# EAGLE design relay (EAGLE 9.6.2)
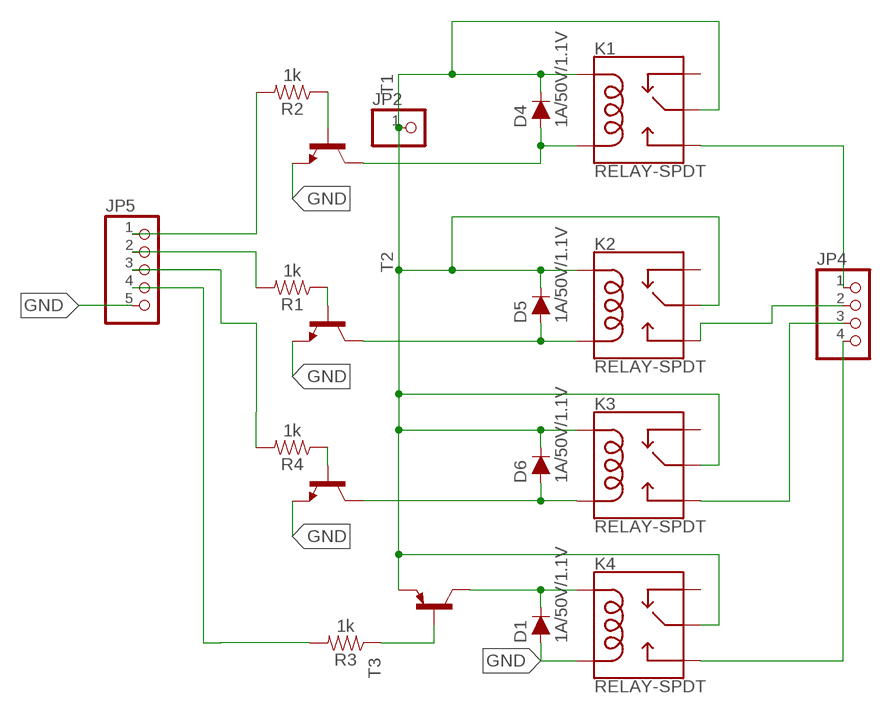
[diagram p0: schematic, sheet 1]

## Parts
D1  1A/50V/1.1V  DIODE-PTH  [DIODE-1N4001]
D4  1A/50V/1.1V  DIODE-PTH  [DIODE-1N4001]
D5  1A/50V/1.1V  DIODE-PTH  [DIODE-1N4001]
D6  1A/50V/1.1V  DIODE-PTH  [DIODE-1N4001]
JP2  PINHD-1X1  [1X01]
JP4  PINHD-1X4  [1X04]
JP5  PINHD-1X5  [1X05]
K1  RELAY-SPDT  [RELAY_G5LE]
K2  RELAY-SPDT  [RELAY_G5LE]
K3  RELAY-SPDT  [RELAY_G5LE]
K4  RELAY-SPDT  [RELAY_G5LE]
R1  1k  1KOHM-HORIZ-1/4W-1%  [AXIAL-0.3]
R2  1k  1KOHM-HORIZ-1/4W-1%  [AXIAL-0.3]
R3  1k  1KOHM-HORIZ-1/4W-1%  [AXIAL-0.3]
R4  1k  1KOHM-HORIZ-1/4W-1%  [AXIAL-0.3]
T1  2N5401-NPN-TO92-CBE  [TO92-CBE]
T2  2N5401-NPN-TO92-CBE  [TO92-CBE]
T3  2N4126-PNP-TO92-CBE  [TO92-CBE]
T4  2N5401-NPN-TO92-CBE  [TO92-CBE]

## Nets
124: D6.A K3.5(COIL2) T4.C
GND: D1.A JP5.5 K4.5(COIL2) T1.E T2.E T4.E
N$1: JP4.1 K1.3(NO)
N$2: JP4.2 K2.3(NO)
N$3: JP4.3 K3.3(NO)
N$5: D5.A K2.5(COIL2) T2.C
N$6: D4.A K1.5(COIL2) T1.C
N$7: R1.P$1 T2.B
N$8: D4.C D5.C D6.C JP2.1 K1.1(MAIN) K1.2(COIL1) K2.1(MAIN) K2.2(COIL1) K3.1(MAIN) K3.2(COIL1) K4.1(MAIN) T3.E
N$9: R3.P$1 T3.B
N$10: JP5.3 R4.P$2
N$11: JP5.2 R1.P$2
N$12: JP5.1 R2.P$2
N$13: R2.P$1 T1.B
N$18: JP4.4 K4.3(NO)
N$19: D1.C K4.2(COIL1) T3.C
N$21: R4.P$1 T4.B
N$23: JP5.4 R3.P$2
Unconnected: K1.4(NC) K2.4(NC) K3.4(NC) K4.4(NC)

## Library data of the parts
D1 D4-D6 = SparkFun-DiscreteSemi:DIODE: Diode These are standard reverse protection diodes and small signal diodes. SparkFun Products: SparkFun SparkPunk Sound Kit <https://www.sparkfun.com/products/11177> SparkFun ESP8266 Thing <https://www.sparkfun.com/products/13231>; PROD_ID: DIO-09176
JP2 = pinhead:PINHD-1X1: PIN HEADER
JP4 = pinhead:PINHD-1X4: PIN HEADER
JP5 = pinhead:PINHD-1X5: PIN HEADER
K1-K4 = SparkFun-Electromechanical:RELAY-SPDT: SPDT Electromechanical Relay Single-pole, double-throw sealed relays. When current is applied to the coil, it throws a simple changeover switch, terminating the connection from the NC contact to ground and closing the NO contact. Use them to switch high voltage/high current devices. SparkFun Products JQX-15F: Relay SPDT Sealed - 20A <https://www.sparkfun.com/products/10924> (COM-10924) JZC-11F: Relay SPDT Sealed <https://www.sparkfun.com/products/100> (COM-00100); PROD_ID: COMP-14214
R1-R4 = SparkFun-Resistors:1KOHM: 1kΩ resistor A resistor is a passive two-terminal electrical component that implements electrical resistance as a circuit element. Resistors act to reduce current flow, and, at the same time, act to lower voltage levels within circuits. - Wikipedia; PROD_ID: RES-12182
T1 = transistor:*-NPN-: NPN Transistror BF959 corrected 2008.03.06
T2 T4 = transistor:*-NPN-: NPN Transistror BF959 corrected 2008.03.06; SPICEPREFIX: J
T3 = transistor:*-PNP-: PNP Transistror

## Board
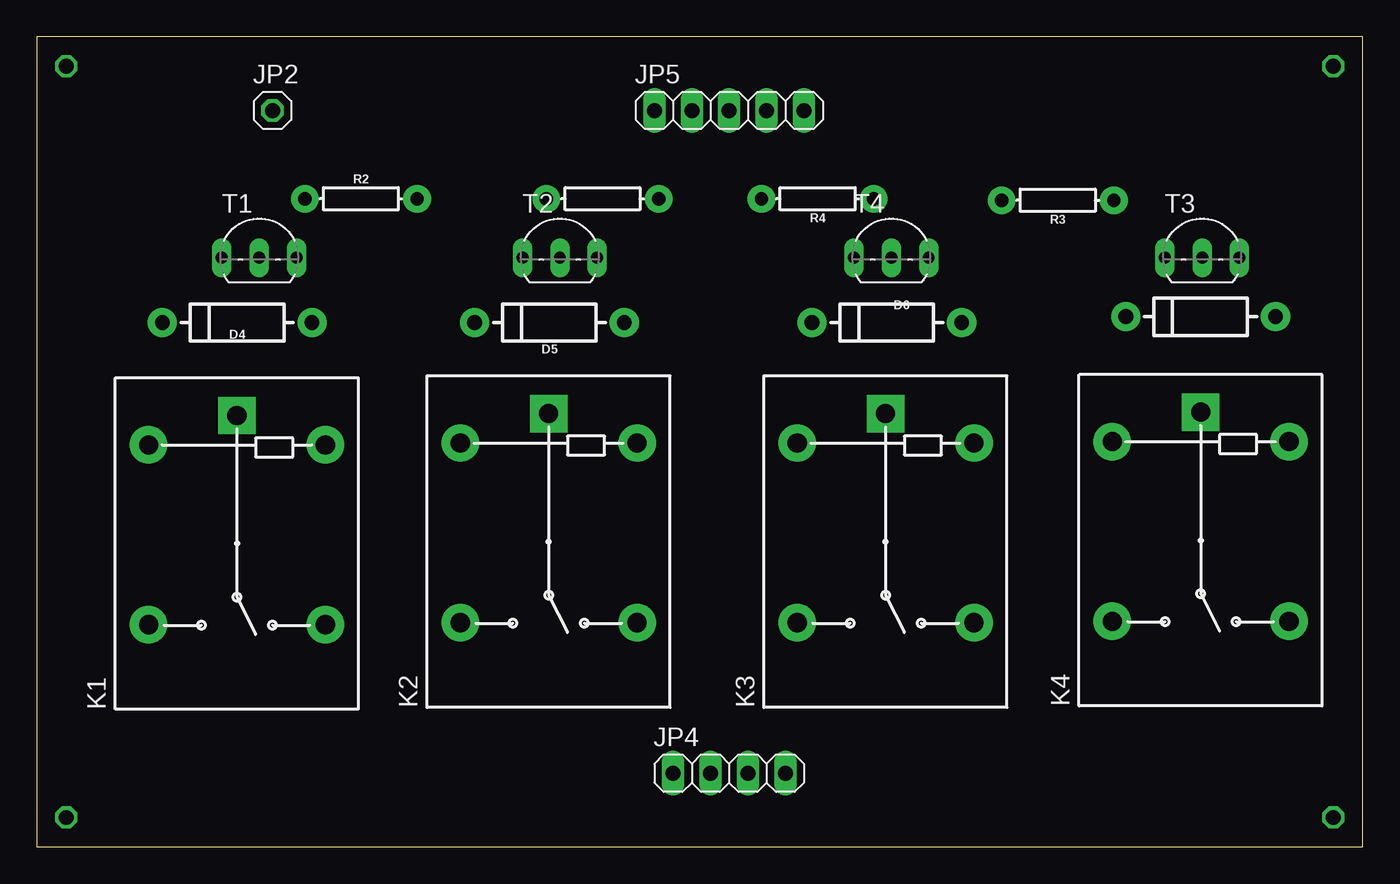
[diagram p1: board, top side]
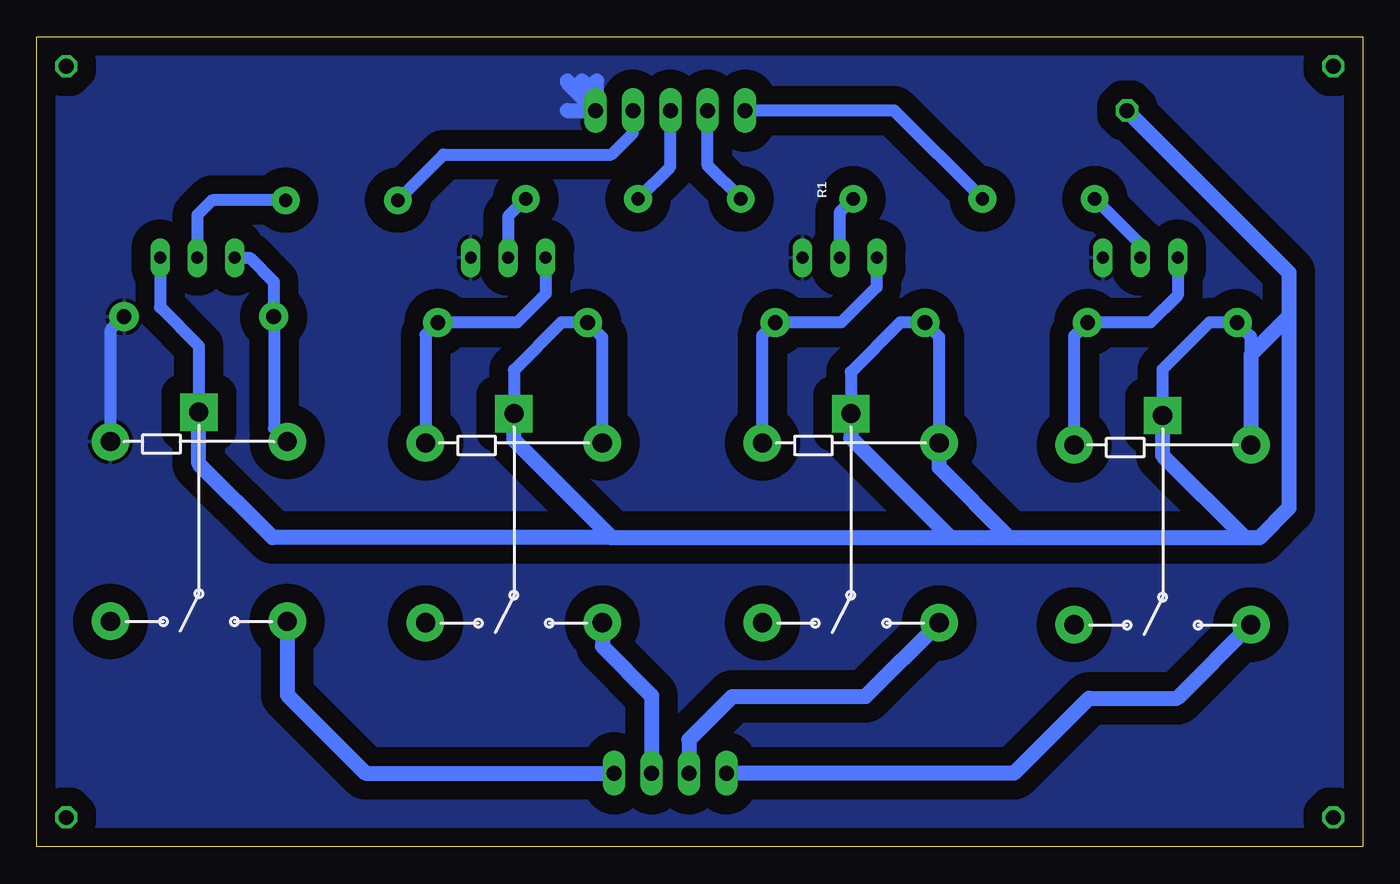
[diagram p2: board, bottom side, seen from below]

Size 90 x 55 mm. Coordinates in mm from the lower left corner, seen from the top.
Outline: 0,0 90,0 90,55 0,55 0,0
Copper layers (1*16): Top 0.035mm / dielectric 1.5mm / Bottom 0.035mm
Design rules "default": minimum track width 6mil, minimum drill 0.35mm, track to track 6mil, track to pad 6mil, pad to pad 6mil, via to via 6mil, smd to smd 6mil, copper to edge 40mil, drill to drill 6mil, minimum pad ring 10mil, minimum via ring 8mil, stop-mask expansion 4mil, vias tented up to drill 0mil, thermal gap 10mil

### Footprints (pad centres in the part's own frame; a part is rotated, then mirrored left to right if it is on the bottom)
DIODE-1N4001 = drill 1 pad 1.981: A -5.08,0; C 5.08,0
1X01 = drill 1.016 octagon: 1 0,0
1X04 = drill 1.016 long: 1 -3.81,0; 2 -1.27,0; 3 1.27,0; 4 3.81,0
1X05 = drill 1.016 long: 1 -5.08,0; 2 -2.54,0; 3 0,0; 4 2.54,0; 5 5.08,0
RELAY_G5LE = drill 1.3 pad 2.54 square: 1 8.52,-0.005 | drill 1.3 pad 2.54: 2 6.52,5.995; 3 -5.68,5.995; 4 -5.68,-6.005; 5 6.52,-6.005
AXIAL-0.3 = drill 0.9 pad 1.88: P$1 -3.81,0; P$2 3.81,0
TO92-CBE = drill 0.813 long: B 0,0; C -2.54,0; E 2.54,0

### Placement (x,y rotation side)
D1  79,36 180 top
D4  13.6,35.6 180 top
D5  34.8,35.6 180 top
D6  57.7,35.6 180 top
JP2  16,50 0 top
JP4  47,5 0 top
JP5  47,50 0 top
K1  13.58,20.77 90 top
K2  34.74,20.9 90 top
K3  57.61,20.9 90 top
K4  79,21 90 top
R1  38.4,44 0 top
R2  22,44 0 top
R3  69.3,43.9 180 top
R4  53,44 180 top
T1  15.1,40 0 top
T2  35.5,40 0 top
T3  79.1,40 0 top
T4  58,40 0 top

### Tracks (layer width: path | path; a pad name or v marks a point on that pad's centre or on a via)
124
  Bottom 0.813: T4.C 55.46,37.54 57.4,35.6 D6.A 63.62,34.77 K3.5
GND
  Bottom 0.813: D1.A 85,35.08 K4.5
  Bottom 1.016: JP5.5 52,50.08 52,52 52.08,51.92 JP5.5 | 54,50 JP5.5 | JP5.5 52.08,50.08 54,52 54,51.92 JP5.5 | JP5.5 52.08,51.08 53,52
  pour Bottom (isolate 1.27): 0,55 0,0 90,0 90,55
N$1
  Bottom 1.016: JP4.1 23.68,5 18.59,10.09 12.59,10.09 K1.3
N$2
  Bottom 1.016: K2.3 33.74,10.22 42.78,10.22 45.73,7.27 JP4.2
N$3
  Bottom 1.016: K3.3 51.62,13.62 48.27,10.27 JP4.3
N$5
  Bottom 0.813: K2.5 40.74,34.73 D5.A 35.4,35.6 33,38 33,39.96 T2.C
N$6
  Bottom 0.813: K1.5 19.59,34.7 D4.A 14.4,35.6 12.56,37.44 T1.C
N$7
  Bottom 0.813: T2.B 35.5,43.09 R1.P$1
N$8
  Bottom 0.813: K1.2 7.58,34.66 D4.C 10.4,35.6 13.59,32.41 K1.1 | K2.2 28.75,28 28.75,34.62 D5.C 31.4,35.6 34.74,32.26 K2.1 | K3.2 51.62,34.59 D6.C | 52.56,35.66 D6.C | D6.C 54.4,35.6 57.62,32.38 K3.1 | T3.E 81.64,36.64 79,34 K4.1
  Bottom 1.016: JP2.1 5,39 5,36 | 5,36 5,23 7,21 8,21 | 51,21 28,21 | 28,21 24,21 | 24,21 8,21 | K2.1 34.74,27.74 28,21 | K1.1 13.59,26.59 8,21 | 5,36 7.58,33.41 K1.2 | 24,21 28.75,25.74 28.75,28 | 51,21 57.62,27.62 K3.1 | 51,21 74,21 79,26.01 K4.1
N$9
  Bottom 0.813: R3.P$1 78.1,43.9 79.1,42.9 T3.B
N$10
  Bottom 0.813: R4.P$2 47,46.19 JP5.3
N$11
  Bottom 0.813: R1.P$2 44.46,46.25 JP5.2
N$12
  Bottom 0.813: R2.P$2 31.81,50 JP5.1
N$13
  Bottom 0.813: R2.P$1 15.1,40.91 T1.B
N$14  (via drill 1 pad 1.3)
  other vias: 2,53
N$15  (via drill 1 pad 1.3)
  other vias: 88,2
N$16  (via drill 1 pad 1.3)
  other vias: 88,53
N$17  (via drill 1 pad 1.3)
  other vias: 2,2
N$18
  Bottom 1.016: K4.3 73,10.32 67.69,5 JP4.4
N$19
  Bottom 0.813: K4.2 73.91,28.42 73.91,35.98 D1.C 73.92,38.36 75.56,40 T3.C
N$21
  Bottom 0.813: R4.P$1 58,42.81 T4.B
N$23
  Bottom 0.813: R3.P$2 62.39,47 51,47 49.54,48.46 JP5.4